# EAGLE design tinypico-fc (EAGLE 9.6.2)
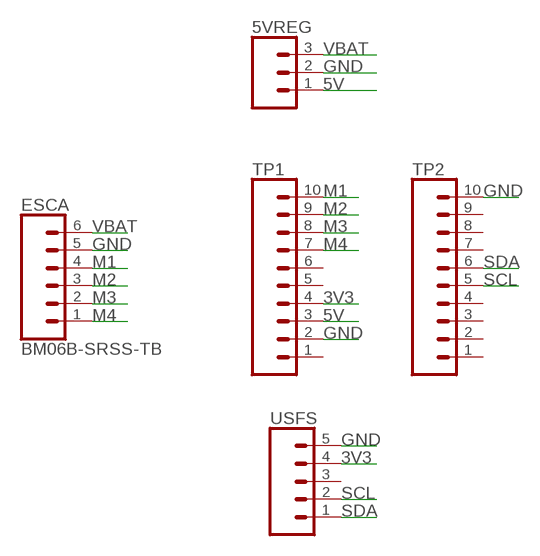
[diagram p0: schematic, sheet 1]

## Parts
5VREG  CONN_031X03_NO_SILK  [1X03_NO_SILK]
ESC  BM06B-SRSS-TB  JST_6_PIN_HORIZONTAL  [JST-6-SMD-HORI-1.0MM]
TP1  CONN_10NO_SILK_PTH_FEMALE  [1X10_NO_SILK]
TP2  CONN_10NO_SILK_PTH_FEMALE  [1X10_NO_SILK]
USFS  CONN_05NO_SILK  [1X05_NO_SILK]

## Nets
3V3: TP1.4 USFS.4
5V: 5VREG.1 TP1.3
GND: 5VREG.2 ESC.5 TP1.2 TP2.10 USFS.5
M1: ESC.4 TP1.10
M2: ESC.3 TP1.9
M3: ESC.2 TP1.8
M4: ESC.1 TP1.7
SCL: TP2.5 USFS.2
SDA: TP2.6 USFS.1
VBAT: 5VREG.3 ESC.6
Unconnected: ESC.M1 ESC.M2 TP1.1 TP1.5 TP1.6 TP2.1 TP2.2 TP2.3 TP2.4 TP2.7 TP2.8 TP2.9 USFS.3

## Library data of the parts
5VREG = SparkFun-Connectors:CONN_03: Multi connection point. Often used as Generic Header-pin footprint for 0.1 inch spaced/style header connections On any of the 0.1 inch spaced packages, you can populate with these: Break Away Headers - Straight <https://www.sparkfun.com/products/116> (PRT-00116) Break Away Male Headers - Right Angle <https://www.sparkfun.com/products/553> (PRT-00553) Female Headers <https://www.sparkfun.com/products/115> (PRT-00115) Break Away Headers - Machine Pin <https://www.sparkfun.com/products/117> (PRT-00117) Break Away Female Headers - Swiss Machine Pin <https://www.sparkfun.com/products/743> (PRT-00743) Stackable Header - 3 Pin (Female, 0.1") <https://www.sparkfun.com/products/13875> (PRT-13875) For SCREWTERMINALS and SPRING TERMINALS visit here: Screw Terimnals on SparkFun.com <https://www.sparkfun.com/search/results?term=Screw+Terminals> (5mm/3.5mm/2.54mm spacing) This device is also useful as a general connection point to wire up your design to another part of your project. Our various solder wires solder well into these plated through hole pads. Hook-Up Wire - Assortment (Stranded, 22 AWG) <https://www.sparkfun.com/products/11375> (PRT-11375) Hook-Up Wire - Assortment (Solid Core, 22 AWG) <https://www.sparkfun.com/products/11367> (PRT-11367) View the entire wire category on our website here <https://www.sparkfun.com/categories/141> Special notes: Molex polarized connector foot print use with SKU : PRT-08232 with associated crimp pins and housings.
ESC = SparkFun-Connectors:JST_6_PIN_HORIZONTAL: JST 6 pin horizontal connector JST-SH type. Here is the connector we sell at SparkFun: name <link> (XXX-00000) Datasheet <http://www.sparkfun.com/datasheets/GPS/EM406-SMDConnector-eSH.pdf> It was used on these SparkFun products: name <link> (XXX-00000) name <link> (XXX-00000); PROD_ID: XXX-00000
TP1 TP2 = SparkFun-Connectors:CONN_10: Multi connection point. Often used as Generic Header-pin footprint for 0.1 inch spaced/style header connections On any of the 0.1 inch spaced packages, you can populate with these: Break Away Headers - Straight <https://www.sparkfun.com/products/116> (PRT-00116) Break Away Male Headers - Right Angle <https://www.sparkfun.com/products/553> (PRT-00553) Female Headers <https://www.sparkfun.com/products/115> (PRT-00115) Break Away Headers - Machine Pin <https://www.sparkfun.com/products/117> (PRT-00117) Break Away Female Headers - Swiss Machine Pin <https://www.sparkfun.com/products/743> (PRT-00743) Arduino Stackable Header - 10 Pin <https://www.sparkfun.com/products/11376> (PRT-11376) For SCREWTERMINALS and SPRING TERMINALS visit here: Screw Terimnals on SparkFun.com <https://www.sparkfun.com/search/results?term=Screw+Terminals> (5mm/3.5mm/2.54mm spacing) This device is also useful as a general connection point to wire up your design to another part of your project. Our various solder wires solder well into these plated through hole pads. Hook-Up Wire - Assortment (Stranded, 22 AWG) <https://www.sparkfun.com/products/11375> (PRT-11375) Hook-Up Wire - Assortment (Solid Core, 22 AWG) <https://www.sparkfun.com/products/11367> (PRT-11367) View the entire wire category on our website here <https://www.sparkfun.com/categories/141> Special notes: Molex polarized connector foot print use with SKU : PRT-08231 with associated crimp pins and housings. 1MM SMD Version SKU: PRT-10208 NOTES ON THE VARIANTS LOCK and LOCK_LONGPADS... This footprint was designed to help hold the alignment of a through-hole component (i.e. 6-pin header) while soldering it into place. You may notice that each hole has been shifted either up or down by 0.005 of an inch from it's more standard position (which is a perfectly straight line). This slight alteration caused the pins (the squares in the middle) to touch the edges of the holes. Because they are alternating, it causes a "brace" to hold the component in place. 0.005 has proven to be the perfect amount of "off-center" position when using our standard breakaway headers. Although looks a little odd when you look at the bare footprint, once you have a header in there, the alteration is very hard to notice. Also,if you push a header all the way into place, it is covered up entirely on the bottom side.
USFS = SparkFun-Connectors:CONN_05: Multi connection point. Often used as Generic Header-pin footprint for 0.1 inch spaced/style header connections On any of the 0.1 inch spaced packages, you can populate with these: Break Away Headers - Straight <https://www.sparkfun.com/products/116> (PRT-00116) Break Away Male Headers - Right Angle <https://www.sparkfun.com/products/553> (PRT-00553) Female Headers <https://www.sparkfun.com/products/115> (PRT-00115) Break Away Headers - Machine Pin <https://www.sparkfun.com/products/117> (PRT-00117) Break Away Female Headers - Swiss Machine Pin <https://www.sparkfun.com/products/743> (PRT-00743) For SCREWTERMINALS and SPRING TERMINALS visit here: Screw Terimnals on SparkFun.com <https://www.sparkfun.com/search/results?term=Screw+Terminals> (5mm/3.5mm/2.54mm spacing) This device is also useful as a general connection point to wire up your design to another part of your project. Our various solder wires solder well into these plated through hole pads. Hook-Up Wire - Assortment (Stranded, 22 AWG) <https://www.sparkfun.com/products/11375> (PRT-11375) Hook-Up Wire - Assortment (Solid Core, 22 AWG) <https://www.sparkfun.com/products/11367> (PRT-11367) View the entire wire category on our website here <https://www.sparkfun.com/categories/141> Special notes: Molex polarized connector foot print use with SKU : PRT-08231 with associated crimp pins and housings. 1MM SMD Version SKU: PRT-10208

## Board
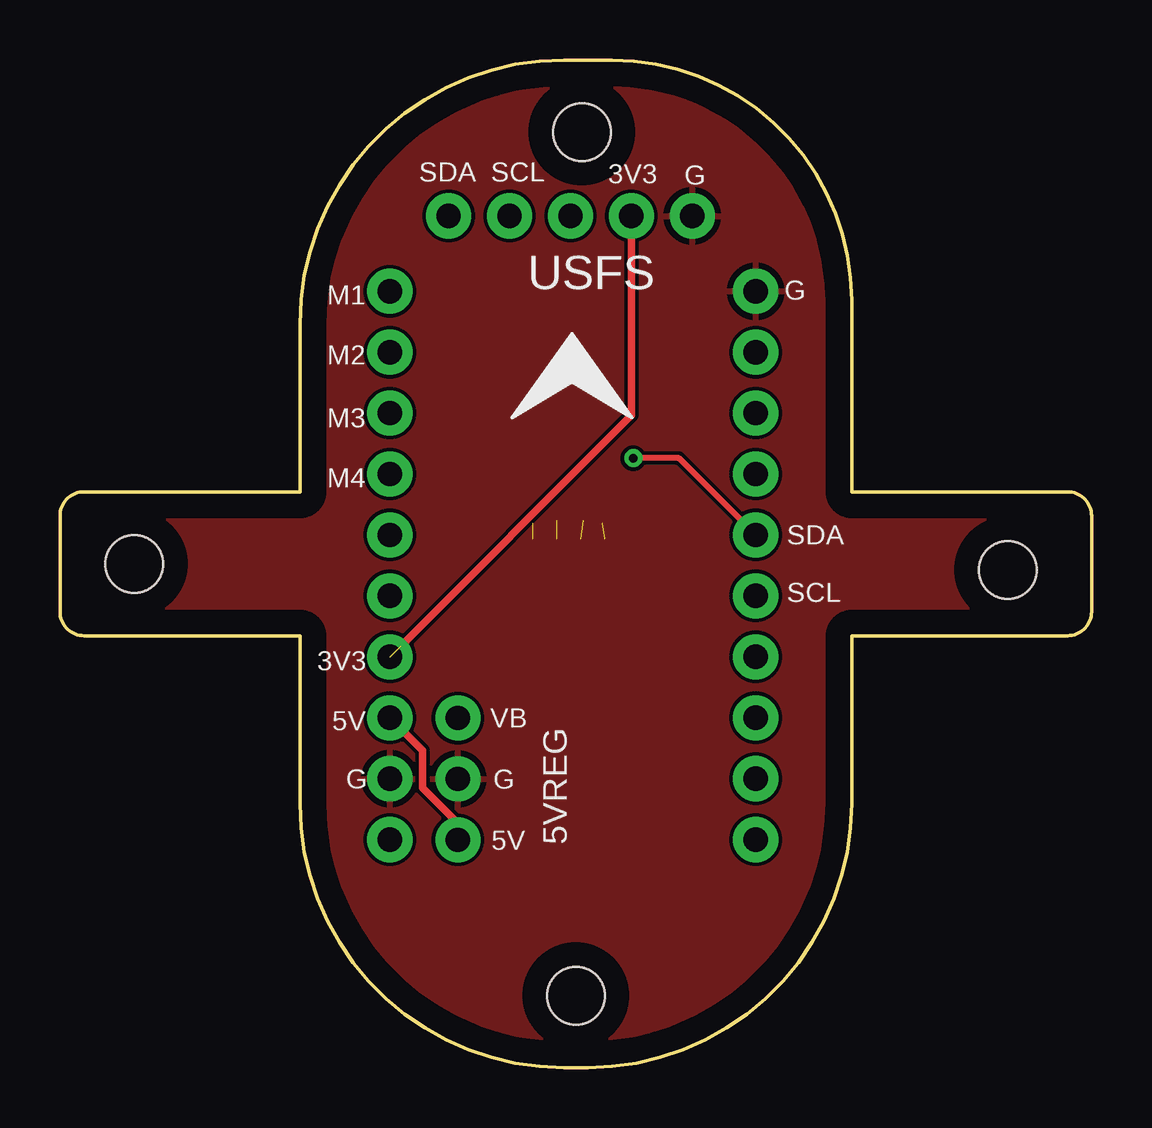
[diagram p1: board, top side]
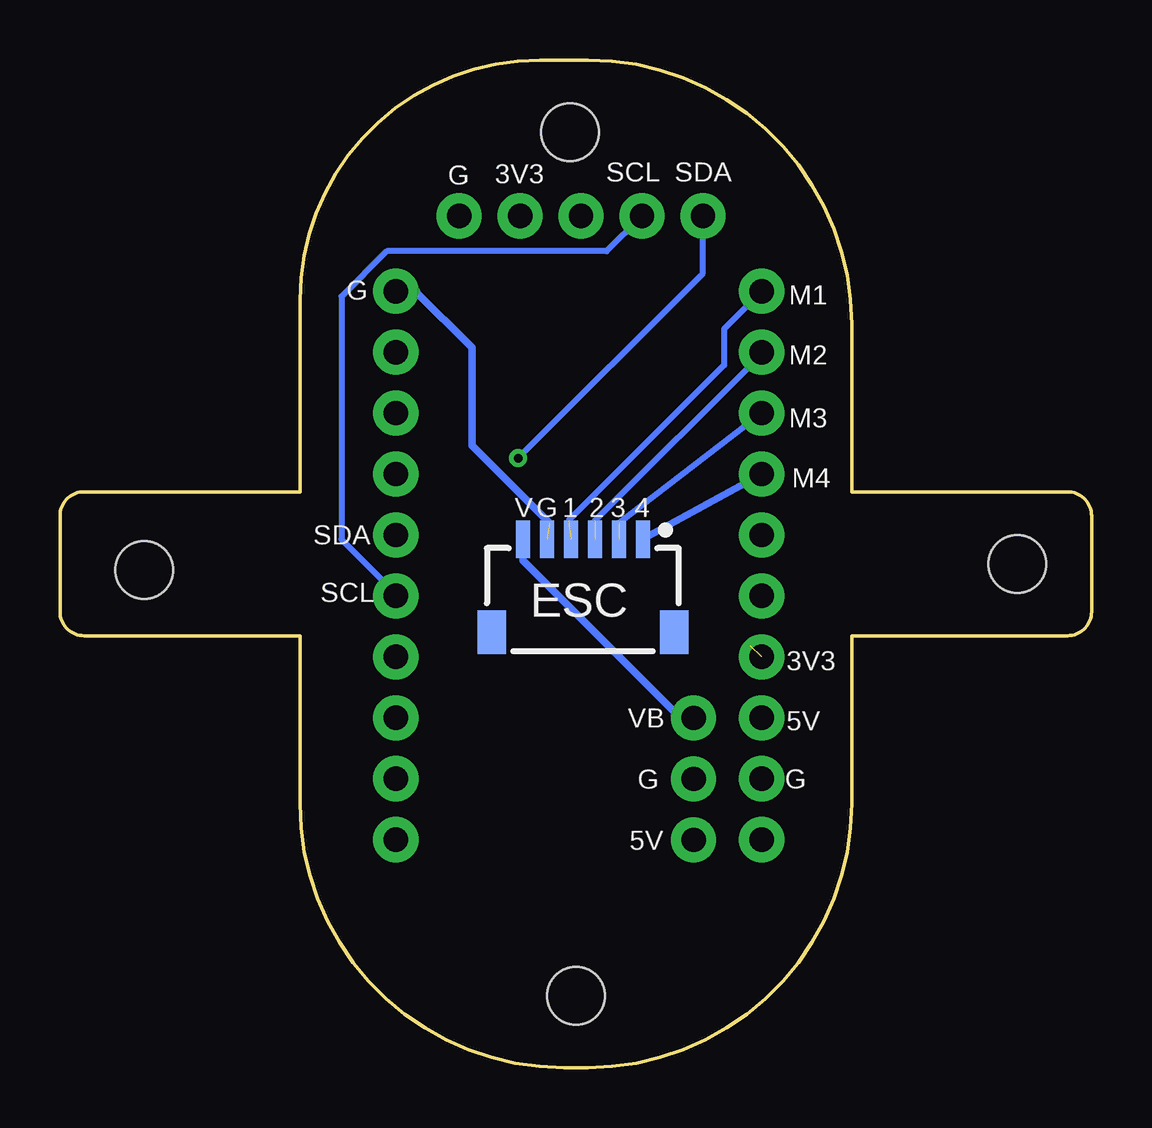
[diagram p2: board, bottom side, seen from below]

Size 43 x 42 mm. Coordinates in mm from the lower left corner, seen from the top.
Outline: 33,18 33,11 arc-90 22,0 21,0 arc-90 10,11 10,18 1,18 arc-90 0,19 0,23 arc-90 1,24 10,24 10,31 arc-90 21,42 23,42 arc-90 33,32 33,24 42,24 arc-90 43,23 43,19 arc-90 42,18 33,18
Copper layers (1*16): Top 0.035mm / dielectric 1.5mm / Bottom 0.035mm
Design rules "default": minimum track width 6mil, minimum drill 0.35mm, track to track 6mil, track to pad 6mil, pad to pad 6mil, via to via 6mil, smd to smd 6mil, copper to edge 40mil, drill to drill 6mil, minimum pad ring 10mil, minimum via ring 8mil, stop-mask expansion 4mil, vias tented up to drill 0mil, thermal gap 10mil
Holes 2.4 mm at 3.1,21 39.5,20.75 21.5,3 21.75,39

### Footprints (pad centres in the part's own frame; a part is rotated, then mirrored left to right if it is on the bottom)
1X03_NO_SILK = drill 1.016 pad 1.88: 1 0,0; 2 2.54,0; 3 5.08,0
JST-6-SMD-HORI-1.0MM = smd 0.6 x 1.55: 1 -2.5,-4.775; 2 -1.5,-4.775; 3 -0.5,-4.775; 4 0.5,-4.775; 5 1.5,-4.775; 6 2.5,-4.775 | smd 1.2 x 1.8: M1 -3.8,-0.9; M2 3.8,-0.9
1X10_NO_SILK = drill 1.016 pad 1.88: 1 0,0; 2 2.54,0; 3 5.08,0; 4 7.62,0; 5 10.16,0; 6 12.7,0; 7 15.24,0; 8 17.78,0; 9 20.32,0; 10 22.86,0
1X05_NO_SILK = drill 1.016 pad 1.88: 1 0,0; 2 2.54,0; 3 5.08,0; 4 7.62,0; 5 10.16,0

### Placement (x,y rotation side)
5VREG  16.59,9.49 90 top
ESC  21.2,17.25 180 bottom
TP1  13.75,9.5 90 top
TP2  29,9.5 90 top
USFS  16.2,35.5 0 top

### Tracks (layer width: path | path; a pad name or v marks a point on that pad's centre or on a via)
3V3  (1 unrouted)
  Top 0.152: 14.21,17.58
  Top 0.305: TP1.4 23.82,27.19 USFS.4
5V
  Top 0.305: TP1.3 15.12,13.21 15.12,11.65 16.59,10.18 5VREG.1
GND  (1 unrouted)
  Bottom 0.305: 22.6,22.7 25.83,25.93 25.83,30 28.19,32.36
  Bottom 0.406: TP2.10 28.19,32.36
  pour Top: 19,44 44,44 44,-2 44,-6 0,-6 0,44
M1  (1 unrouted)
  Bottom 0.254: 21.8,22.8 15.32,29.28 15.32,30.79 TP1.10
M2  (1 unrouted)
  Bottom 0.254: TP1.9 13.75,29.75 20.7,22.8
M3  (1 unrouted)
  Bottom 0.254: TP1.8 19.7,22.7
M4
  Bottom 0.305: TP1.7 ESC.1
SCL
  Bottom 0.152: 29,19.75 TP2.5
  Bottom 0.254: 29,19.75 31.27,22.02 31.27,32.14 29.38,34.03 20.21,34.03 USFS.2
SDA  (via drill 0.35)
  Top 0.254: TP2.6 25.8,25.4 v23.9,25.4
  Bottom 0.254: v23.9,25.4 16.2,33.1 USFS.1
VBAT
  Bottom 0.305: 5VREG.3 17.14,14.57 23.7,21.13 ESC.6

### Text on the board
tPlace: USFS
bPlace: ESC | SCL
tNames: SDA | SCL | 3V3 | G | M1 | G | M2 | M3 | M4 | SDA | SCL | 3V3 | 5V | VB | 5VREG | G | G | 5V
bNames: SDA | SCL | 3V3 | G | M1 | G | M2 | M3 | M4 | 4 | 3 | 2 | 1 | G | V | SDA | 3V3 | 5V | VB | G | G | 5V